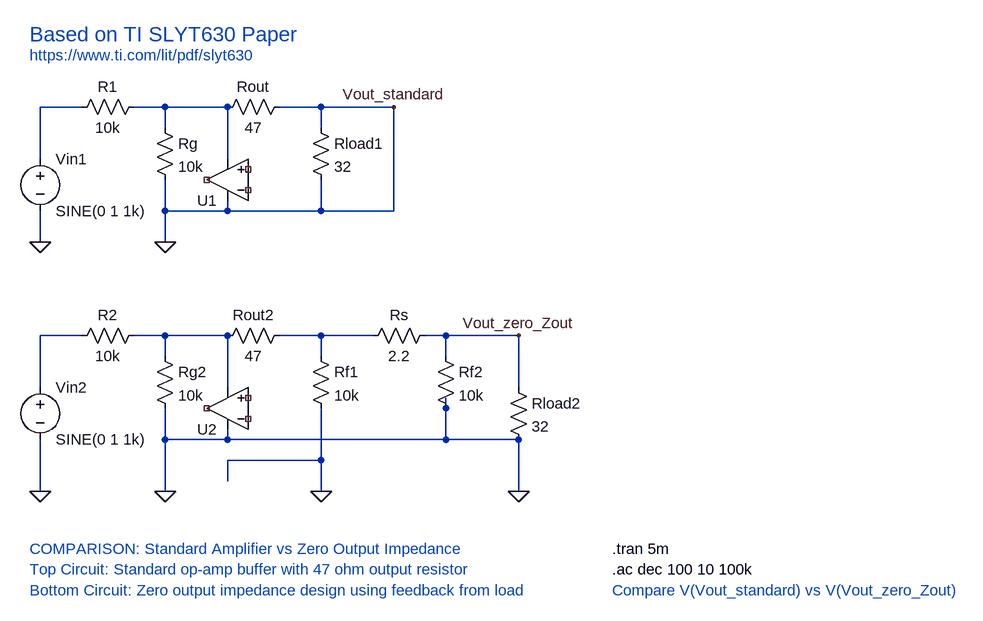
[diagram p0: schematic comparison_standard_vs_zero_zout.asc]
comparison_standard_vs_zero_zout.asc, the LTspice schematic file:
Version 4
SHEET 1 1600 900
WIRE 128 96 64 96
WIRE 256 96 208 96
WIRE 352 96 256 96
WIRE 496 96 432 96
WIRE 608 96 496 96
WIRE 256 128 256 96
WIRE 496 128 496 96
WIRE 64 176 64 96
WIRE 352 176 352 96
WIRE 256 256 256 208
WIRE 352 256 352 240
WIRE 352 256 256 256
WIRE 496 256 496 208
WIRE 496 256 352 256
WIRE 608 256 608 96
WIRE 608 256 496 256
WIRE 64 304 64 256
WIRE 256 304 256 256
FLAG 64 304 0
FLAG 256 304 0
FLAG 608 96 Vout_standard
SYMBOL voltage 64 160 R0
WINDOW 123 0 0 Left 0
WINDOW 39 0 0 Left 0
SYMATTR InstName Vin1
SYMATTR Value SINE(0 1 1k)
SYMBOL res 112 112 R270
WINDOW 0 32 56 VTop 2
WINDOW 3 0 56 VBottom 2
SYMATTR InstName R1
SYMATTR Value 10k
SYMBOL res 240 112 R0
SYMATTR InstName Rg
SYMATTR Value 10k
SYMBOL Opamps/UniversalOpAmp2 352 208 R180
SYMATTR InstName U1
SYMATTR Value2 Avol=100k GBW=10Meg Slew=5Meg
SYMBOL res 336 112 R270
WINDOW 0 32 56 VTop 2
WINDOW 3 0 56 VBottom 2
SYMATTR InstName Rout
SYMATTR Value 47
SYMBOL res 480 112 R0
SYMATTR InstName Rload1
SYMATTR Value 32
WIRE 128 448 64 448
WIRE 256 448 208 448
WIRE 352 448 256 448
WIRE 496 448 432 448
WIRE 576 448 496 448
WIRE 688 448 656 448
WIRE 800 448 688 448
WIRE 256 480 256 448
WIRE 496 480 496 448
WIRE 688 480 688 448
WIRE 64 528 64 448
WIRE 352 528 352 448
WIRE 800 528 800 448
WIRE 256 608 256 560
WIRE 352 608 352 592
WIRE 352 608 256 608
WIRE 688 608 688 544
WIRE 688 608 352 608
WIRE 800 608 688 608
WIRE 496 640 496 560
WIRE 496 640 352 640
WIRE 352 672 352 640
WIRE 64 688 64 608
WIRE 256 688 256 608
WIRE 496 688 496 640
WIRE 800 688 800 608
FLAG 64 688 0
FLAG 256 688 0
FLAG 800 448 Vout_zero_Zout
FLAG 800 688 0
FLAG 496 688 0
SYMBOL voltage 64 512 R0
WINDOW 123 0 0 Left 0
WINDOW 39 0 0 Left 0
SYMATTR InstName Vin2
SYMATTR Value SINE(0 1 1k)
SYMBOL res 112 464 R270
WINDOW 0 32 56 VTop 2
WINDOW 3 0 56 VBottom 2
SYMATTR InstName R2
SYMATTR Value 10k
SYMBOL res 240 464 R0
SYMATTR InstName Rg2
SYMATTR Value 10k
SYMBOL Opamps/UniversalOpAmp2 352 560 R180
SYMATTR InstName U2
SYMATTR Value2 Avol=100k GBW=10Meg Slew=5Meg
SYMBOL res 336 464 R270
WINDOW 0 32 56 VTop 2
WINDOW 3 0 56 VBottom 2
SYMATTR InstName Rout2
SYMATTR Value 47
SYMBOL res 560 464 R270
WINDOW 0 32 56 VTop 2
WINDOW 3 0 56 VBottom 2
SYMATTR InstName Rs
SYMATTR Value 2.2
SYMBOL res 480 464 R0
SYMATTR InstName Rf1
SYMATTR Value 10k
SYMBOL res 672 464 R0
SYMATTR InstName Rf2
SYMATTR Value 10k
SYMBOL res 784 512 R0
SYMATTR InstName Rload2
SYMATTR Value 32
TEXT 48 776 Left 2 ;COMPARISON: Standard Amplifier vs Zero Output Impedance
TEXT 48 808 Left 2 ;Top Circuit: Standard op-amp buffer with 47 ohm output resistor
TEXT 48 840 Left 2 ;Bottom Circuit: Zero output impedance design using feedback from load
TEXT 48 -16 Left 3 ;Based on TI SLYT630 Paper
TEXT 48 16 Left 2 ;https://www.ti.com/lit/pdf/slyt630
TEXT 944 776 Left 2 !.tran 5m
TEXT 944 808 Left 2 !.ac dec 100 10 100k
TEXT 944 840 Left 2 ;Compare V(Vout_standard) vs V(Vout_zero_Zout)

The netlist it stands for:
* comparison_standard_vs_zero_zout.asc
Vin1 N001 0 SINE(0 1 1k)
R1 N001 N002 10k
Rg N002 0 10k
XU1 NC_01 NC_02 0 N002 NC_03 level2 Avol=100k GBW=10Meg Slew=5Meg Ilimit=25m Rail=0 Vos=0 En=0 Enk=0 In=0 Ink=0 Rin=500Meg  ; pins In+ In- V+ V- OUT
Rout N002 0 47
Rload1 0 0 32
Vin2 N003 0 SINE(0 1 1k)
R2 N003 N004 10k
Rg2 N004 0 10k
XU2 NC_04 NC_05 0 N004 NC_06 level2 Avol=100k GBW=10Meg Slew=5Meg Ilimit=25m Rail=0 Vos=0 En=0 Enk=0 In=0 Ink=0 Rin=500Meg  ; pins In+ In- V+ V- OUT
Rout2 N004 N005 47
Rs N005 Vout_zero_Zout 2.2
Rf1 N005 0 10k
Rf2 Vout_zero_Zout 0 10k
Rload2 Vout_zero_Zout 0 32
* COMPARISON: Standard Amplifier vs Zero Output Impedance
* Top Circuit: Standard op-amp buffer with 47 ohm output resistor
* Bottom Circuit: Zero output impedance design using feedback from load
* Based on TI SLYT630 Paper
* https://www.ti.com/lit/pdf/slyt630
.tran 5m
.ac dec 100 10 100k
* Compare V(Vout_standard) vs V(Vout_zero_Zout)
.lib UniversalOpAmp2.lib
.backanno
.end